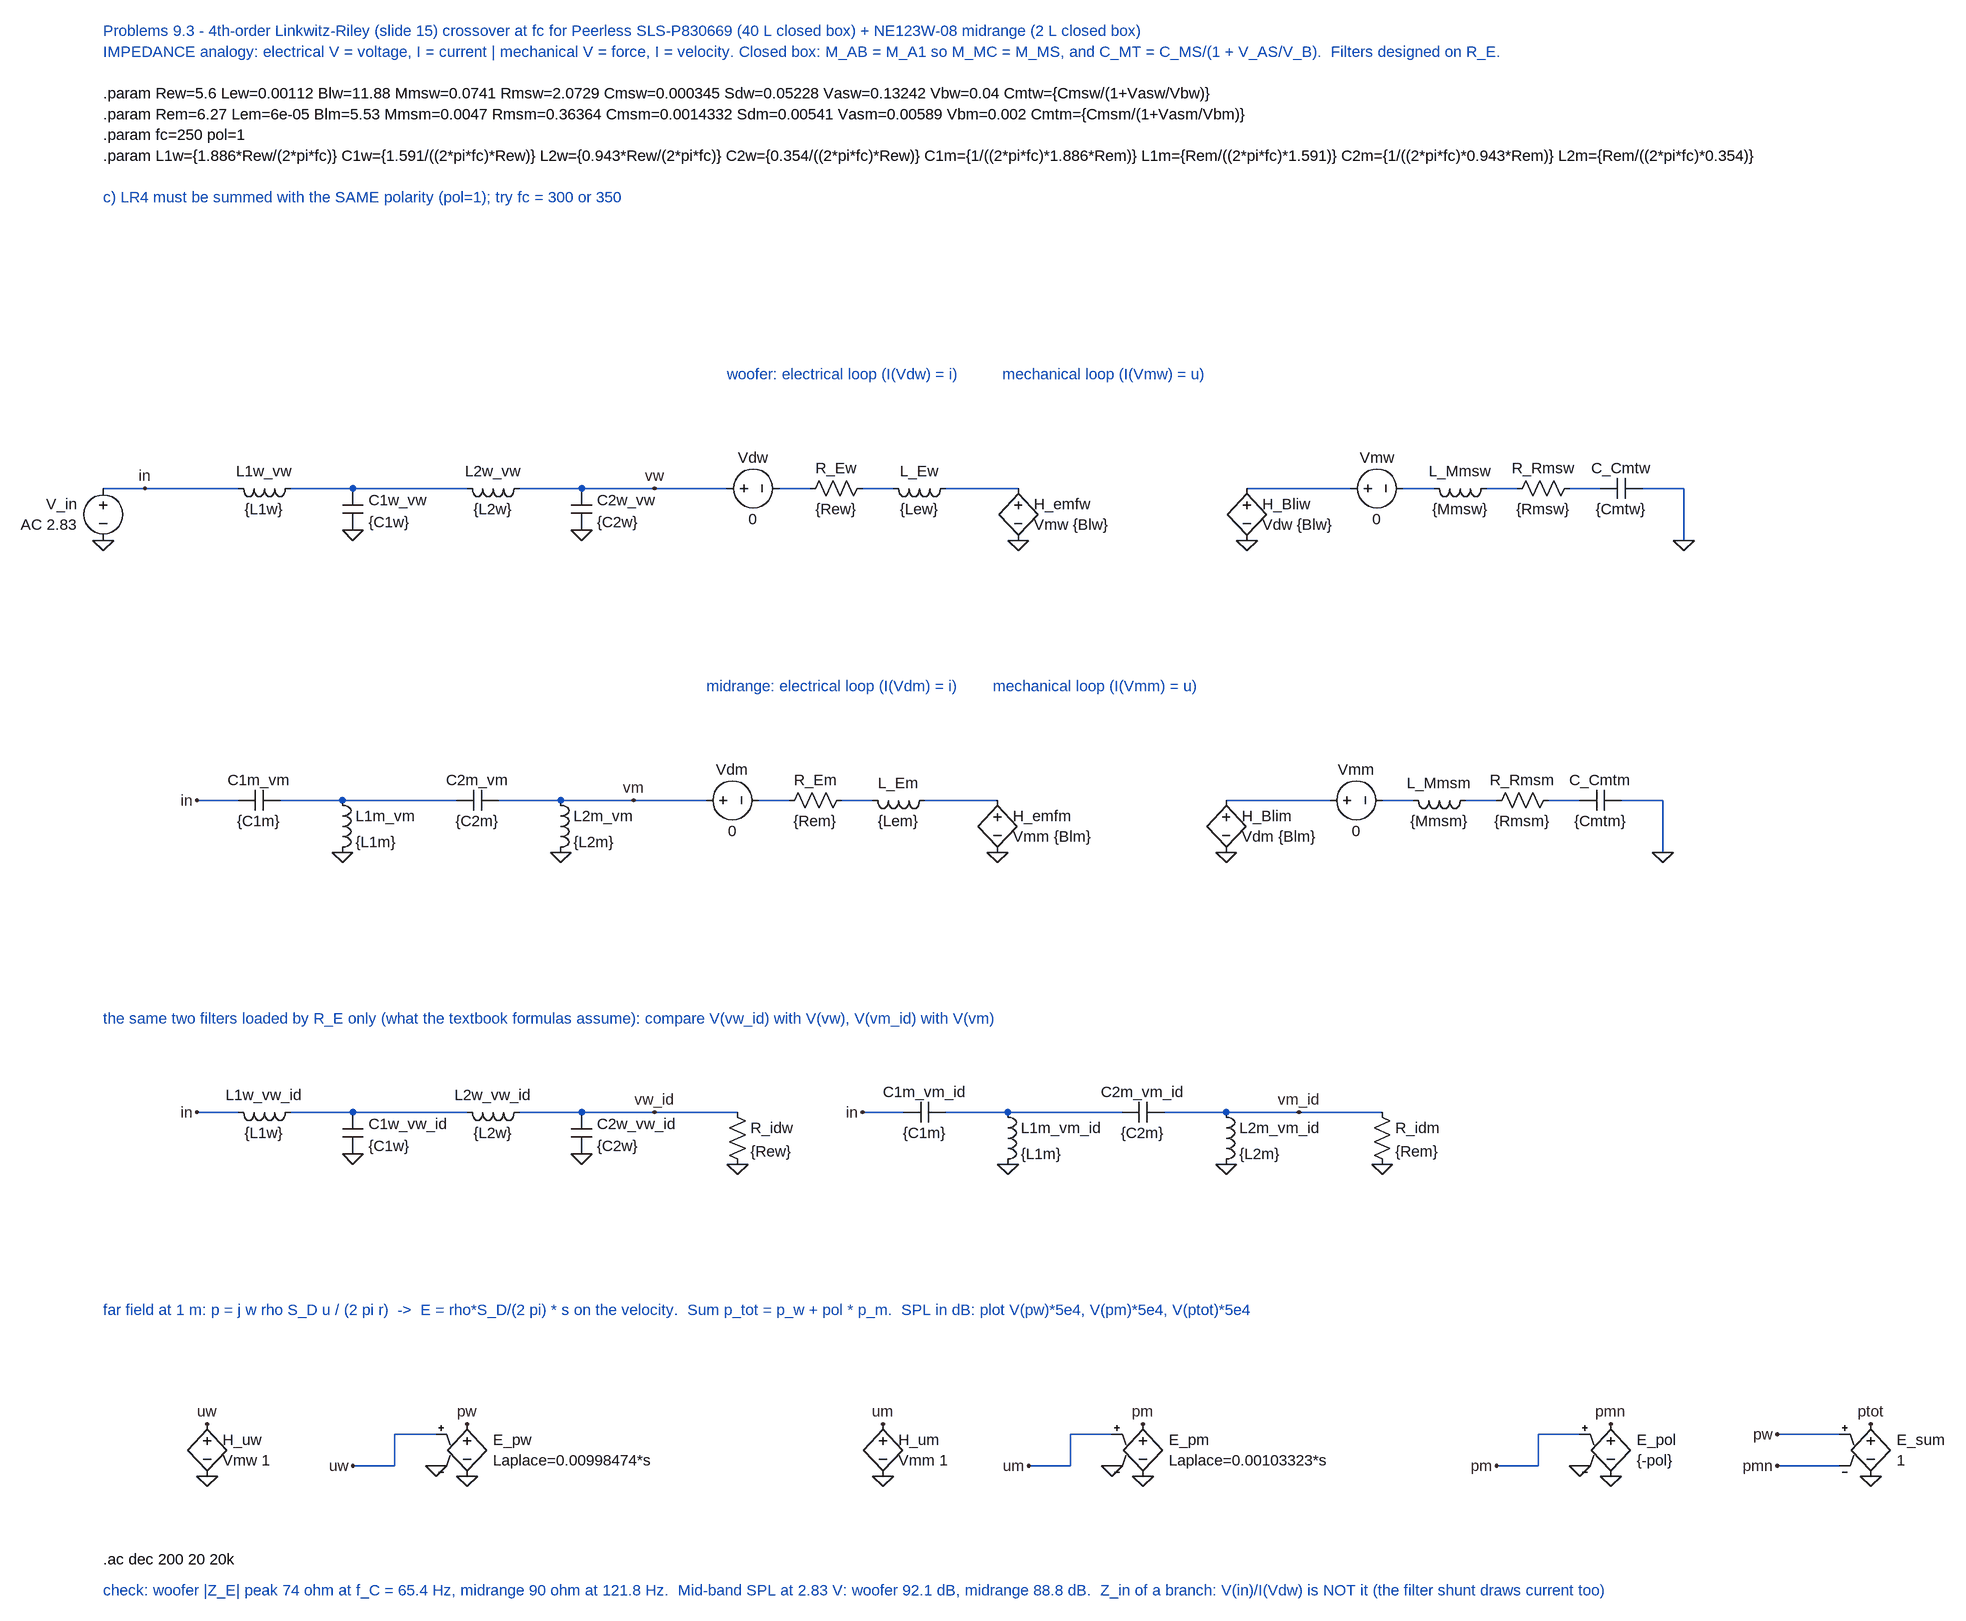
[diagram p0: schematic P9_3_LR4_250Hz.asc]
P9_3_LR4_250Hz.asc, the LTspice schematic file:
Version 4
SHEET 1 3000 1600
WIRE 0 0 144 0
WIRE 144 0 208 0
WIRE 288 0 384 0
WIRE 384 0 560 0
WIRE 640 0 736 0
WIRE 736 0 912 0
WIRE 1040 0 1088 0
WIRE 1168 0 1216 0
WIRE 1296 0 1408 0
WIRE 1760 0 1920 0
WIRE 2000 0 2048 0
WIRE 2128 0 2176 0
WIRE 2256 0 2304 0
WIRE 2368 0 2432 0
WIRE 2432 0 2432 80
WIRE 912 0 960 0
WIRE 144 480 208 480
WIRE 272 480 368 480
WIRE 368 480 544 480
WIRE 608 480 704 480
WIRE 704 480 880 480
WIRE 1008 480 1056 480
WIRE 1136 480 1184 480
WIRE 1264 480 1376 480
WIRE 1728 480 1888 480
WIRE 1968 480 2016 480
WIRE 2096 480 2144 480
WIRE 2224 480 2272 480
WIRE 2336 480 2400 480
WIRE 2400 480 2400 560
WIRE 880 480 928 480
WIRE 144 960 208 960
WIRE 288 960 384 960
WIRE 384 960 560 960
WIRE 640 960 736 960
WIRE 736 960 912 960
WIRE 912 960 976 960
WIRE 1168 960 1232 960
WIRE 1296 960 1392 960
WIRE 1392 960 1568 960
WIRE 1632 960 1728 960
WIRE 1728 960 1904 960
WIRE 1904 960 1968 960
WIRE 512 1456 448 1456
WIRE 448 1456 448 1504
WIRE 448 1504 384 1504
WIRE 1552 1456 1488 1456
WIRE 1488 1456 1488 1504
WIRE 1488 1504 1424 1504
WIRE 2272 1456 2208 1456
WIRE 2208 1456 2208 1504
WIRE 2208 1504 2144 1504
WIRE 2672 1456 2576 1456
WIRE 2672 1504 2576 1504
FLAG 0 80 0
FLAG 64 0 in
FLAG 384 64 0
FLAG 736 64 0
FLAG 848 0 vw
FLAG 1408 80 0
FLAG 1760 80 0
FLAG 2432 80 0
FLAG 144 480 in
FLAG 368 560 0
FLAG 704 560 0
FLAG 816 480 vm
FLAG 1376 560 0
FLAG 1728 560 0
FLAG 2400 560 0
FLAG 144 960 in
FLAG 384 1024 0
FLAG 736 1024 0
FLAG 848 960 vw_id
FLAG 976 1040 0
FLAG 1168 960 in
FLAG 1392 1040 0
FLAG 1728 1040 0
FLAG 1840 960 vm_id
FLAG 1968 1040 0
FLAG 160 1520 0
FLAG 160 1440 uw
FLAG 560 1520 0
FLAG 512 1504 0
FLAG 384 1504 uw
FLAG 560 1440 pw
FLAG 1200 1520 0
FLAG 1200 1440 um
FLAG 1600 1520 0
FLAG 1552 1504 0
FLAG 1424 1504 um
FLAG 1600 1440 pm
FLAG 2320 1520 0
FLAG 2272 1504 0
FLAG 2144 1504 pm
FLAG 2320 1440 pmn
FLAG 2720 1520 0
FLAG 2720 1440 ptot
FLAG 2576 1456 pw
FLAG 2576 1504 pmn
SYMBOL voltage 0 -16 R0
WINDOW 0 -40 40 Right 2
WINDOW 3 -40 72 Right 2
SYMATTR InstName V_in
SYMATTR Value AC 2.83
SYMBOL ind 304 -16 R90
WINDOW 0 5 56 VBottom 2
WINDOW 3 32 56 VTop 2
SYMATTR InstName L1w_vw
SYMATTR Value {L1w}
SYMATTR SpiceLine Rser=0
SYMBOL cap 368 0 R0
WINDOW 0 40 18 Left 2
WINDOW 3 40 52 Left 2
SYMATTR InstName C1w_vw
SYMATTR Value {C1w}
SYMBOL ind 656 -16 R90
WINDOW 0 5 56 VBottom 2
WINDOW 3 32 56 VTop 2
SYMATTR InstName L2w_vw
SYMATTR Value {L2w}
SYMATTR SpiceLine Rser=0
SYMBOL cap 720 0 R0
WINDOW 0 40 18 Left 2
WINDOW 3 40 52 Left 2
SYMATTR InstName C2w_vw
SYMATTR Value {C2w}
SYMBOL voltage 944 0 R270
WINDOW 0 32 56 VTop 2
WINDOW 3 -32 56 VBottom 2
SYMATTR InstName Vdw
SYMATTR Value 0
SYMBOL res 1184 -16 R90
WINDOW 0 0 56 VBottom 2
WINDOW 3 32 56 VTop 2
SYMATTR InstName R_Ew
SYMATTR Value {Rew}
SYMBOL ind 1312 -16 R90
WINDOW 0 5 56 VBottom 2
WINDOW 3 32 56 VTop 2
SYMATTR InstName L_Ew
SYMATTR Value {Lew}
SYMATTR SpiceLine Rser=0
SYMBOL h 1408 -16 R0
WINDOW 0 24 40 Left 2
WINDOW 3 24 72 Left 2
SYMATTR InstName H_emfw
SYMATTR Value Vmw {Blw}
SYMBOL h 1760 -16 R0
WINDOW 0 24 40 Left 2
WINDOW 3 24 72 Left 2
SYMATTR InstName H_Bliw
SYMATTR Value Vdw {Blw}
SYMBOL voltage 1904 0 R270
WINDOW 0 32 56 VTop 2
WINDOW 3 -32 56 VBottom 2
SYMATTR InstName Vmw
SYMATTR Value 0
SYMBOL ind 2144 -16 R90
WINDOW 0 5 56 VBottom 2
WINDOW 3 32 56 VTop 2
SYMATTR InstName L_Mmsw
SYMATTR Value {Mmsw}
SYMATTR SpiceLine Rser=0
SYMBOL res 2272 -16 R90
WINDOW 0 0 56 VBottom 2
WINDOW 3 32 56 VTop 2
SYMATTR InstName R_Rmsw
SYMATTR Value {Rmsw}
SYMBOL cap 2368 -16 R90
WINDOW 0 0 32 VBottom 2
WINDOW 3 32 32 VTop 2
SYMATTR InstName C_Cmtw
SYMATTR Value {Cmtw}
SYMBOL cap 272 464 R90
WINDOW 0 0 32 VBottom 2
WINDOW 3 32 32 VTop 2
SYMATTR InstName C1m_vm
SYMATTR Value {C1m}
SYMBOL ind 352 464 R0
SYMATTR InstName L1m_vm
SYMATTR Value {L1m}
SYMATTR SpiceLine Rser=0
SYMBOL cap 608 464 R90
WINDOW 0 0 32 VBottom 2
WINDOW 3 32 32 VTop 2
SYMATTR InstName C2m_vm
SYMATTR Value {C2m}
SYMBOL ind 688 464 R0
SYMATTR InstName L2m_vm
SYMATTR Value {L2m}
SYMATTR SpiceLine Rser=0
SYMBOL voltage 912 480 R270
WINDOW 0 32 56 VTop 2
WINDOW 3 -32 56 VBottom 2
SYMATTR InstName Vdm
SYMATTR Value 0
SYMBOL res 1152 464 R90
WINDOW 0 0 56 VBottom 2
WINDOW 3 32 56 VTop 2
SYMATTR InstName R_Em
SYMATTR Value {Rem}
SYMBOL ind 1280 464 R90
WINDOW 0 5 56 VBottom 2
WINDOW 3 32 56 VTop 2
SYMATTR InstName L_Em
SYMATTR Value {Lem}
SYMATTR SpiceLine Rser=0
SYMBOL h 1376 464 R0
WINDOW 0 24 40 Left 2
WINDOW 3 24 72 Left 2
SYMATTR InstName H_emfm
SYMATTR Value Vmm {Blm}
SYMBOL h 1728 464 R0
WINDOW 0 24 40 Left 2
WINDOW 3 24 72 Left 2
SYMATTR InstName H_Blim
SYMATTR Value Vdm {Blm}
SYMBOL voltage 1872 480 R270
WINDOW 0 32 56 VTop 2
WINDOW 3 -32 56 VBottom 2
SYMATTR InstName Vmm
SYMATTR Value 0
SYMBOL ind 2112 464 R90
WINDOW 0 5 56 VBottom 2
WINDOW 3 32 56 VTop 2
SYMATTR InstName L_Mmsm
SYMATTR Value {Mmsm}
SYMATTR SpiceLine Rser=0
SYMBOL res 2240 464 R90
WINDOW 0 0 56 VBottom 2
WINDOW 3 32 56 VTop 2
SYMATTR InstName R_Rmsm
SYMATTR Value {Rmsm}
SYMBOL cap 2336 464 R90
WINDOW 0 0 32 VBottom 2
WINDOW 3 32 32 VTop 2
SYMATTR InstName C_Cmtm
SYMATTR Value {Cmtm}
SYMBOL ind 304 944 R90
WINDOW 0 5 56 VBottom 2
WINDOW 3 32 56 VTop 2
SYMATTR InstName L1w_vw_id
SYMATTR Value {L1w}
SYMATTR SpiceLine Rser=0
SYMBOL cap 368 960 R0
WINDOW 0 40 18 Left 2
WINDOW 3 40 52 Left 2
SYMATTR InstName C1w_vw_id
SYMATTR Value {C1w}
SYMBOL ind 656 944 R90
WINDOW 0 5 56 VBottom 2
WINDOW 3 32 56 VTop 2
SYMATTR InstName L2w_vw_id
SYMATTR Value {L2w}
SYMATTR SpiceLine Rser=0
SYMBOL cap 720 960 R0
WINDOW 0 40 18 Left 2
WINDOW 3 40 52 Left 2
SYMATTR InstName C2w_vw_id
SYMATTR Value {C2w}
SYMBOL res 960 944 R0
SYMATTR InstName R_idw
SYMATTR Value {Rew}
SYMBOL cap 1296 944 R90
WINDOW 0 0 32 VBottom 2
WINDOW 3 32 32 VTop 2
SYMATTR InstName C1m_vm_id
SYMATTR Value {C1m}
SYMBOL ind 1376 944 R0
SYMATTR InstName L1m_vm_id
SYMATTR Value {L1m}
SYMATTR SpiceLine Rser=0
SYMBOL cap 1632 944 R90
WINDOW 0 0 32 VBottom 2
WINDOW 3 32 32 VTop 2
SYMATTR InstName C2m_vm_id
SYMATTR Value {C2m}
SYMBOL ind 1712 944 R0
SYMATTR InstName L2m_vm_id
SYMATTR Value {L2m}
SYMATTR SpiceLine Rser=0
SYMBOL res 1952 944 R0
SYMATTR InstName R_idm
SYMATTR Value {Rem}
SYMBOL h 160 1424 R0
WINDOW 0 24 40 Left 2
WINDOW 3 24 72 Left 2
SYMATTR InstName H_uw
SYMATTR Value Vmw 1
SYMBOL e 560 1424 R0
WINDOW 0 40 40 Left 2
WINDOW 3 40 72 Left 2
SYMATTR InstName E_pw
SYMATTR Value Laplace=0.00998474*s
SYMBOL h 1200 1424 R0
WINDOW 0 24 40 Left 2
WINDOW 3 24 72 Left 2
SYMATTR InstName H_um
SYMATTR Value Vmm 1
SYMBOL e 1600 1424 R0
WINDOW 0 40 40 Left 2
WINDOW 3 40 72 Left 2
SYMATTR InstName E_pm
SYMATTR Value Laplace=0.00103323*s
SYMBOL e 2320 1424 R0
WINDOW 0 40 40 Left 2
WINDOW 3 40 72 Left 2
SYMATTR InstName E_pol
SYMATTR Value {-pol}
SYMBOL e 2720 1424 R0
WINDOW 0 40 40 Left 2
WINDOW 3 40 72 Left 2
SYMATTR InstName E_sum
SYMATTR Value 1
TEXT 0 -704 Left 2 ;Problems 9.3 - 4th-order Linkwitz-Riley (slide 15) crossover at fc for Peerless SLS-P830669 (40 L closed box) + NE123W-08 midrange (2 L closed box)
TEXT 0 -672 Left 2 ;IMPEDANCE analogy: electrical V = voltage, I = current | mechanical V = force, I = velocity. Closed box: M_AB = M_A1 so M_MC = M_MS, and C_MT = C_MS/(1 + V_AS/V_B).  Filters designed on R_E.
TEXT 0 -608 Left 2 !.param Rew=5.6 Lew=0.00112 Blw=11.88 Mmsw=0.0741 Rmsw=2.0729 Cmsw=0.000345 Sdw=0.05228 Vasw=0.13242 Vbw=0.04 Cmtw={Cmsw/(1+Vasw/Vbw)}
TEXT 0 -576 Left 2 !.param Rem=6.27 Lem=6e-05 Blm=5.53 Mmsm=0.0047 Rmsm=0.36364 Cmsm=0.0014332 Sdm=0.00541 Vasm=0.00589 Vbm=0.002 Cmtm={Cmsm/(1+Vasm/Vbm)}
TEXT 0 -544 Left 2 !.param fc=250 pol=1
TEXT 0 -512 Left 2 !.param L1w={1.886*Rew/(2*pi*fc)} C1w={1.591/((2*pi*fc)*Rew)} L2w={0.943*Rew/(2*pi*fc)} C2w={0.354/((2*pi*fc)*Rew)} C1m={1/((2*pi*fc)*1.886*Rem)} L1m={Rem/((2*pi*fc)*1.591)} C2m={1/((2*pi*fc)*0.943*Rem)} L2m={Rem/((2*pi*fc)*0.354)}
TEXT 0 -448 Left 2 ;c) LR4 must be summed with the SAME polarity (pol=1); try fc = 300 or 350
TEXT 960 -176 Left 2 ;woofer: electrical loop (I(Vdw) = i)          mechanical loop (I(Vmw) = u)
TEXT 928 304 Left 2 ;midrange: electrical loop (I(Vdm) = i)        mechanical loop (I(Vmm) = u)
TEXT 0 816 Left 2 ;the same two filters loaded by R_E only (what the textbook formulas assume): compare V(vw_id) with V(vw), V(vm_id) with V(vm)
TEXT 0 1264 Left 2 ;far field at 1 m: p = j w rho S_D u / (2 pi r)  ->  E = rho*S_D/(2 pi) * s on the velocity.  Sum p_tot = p_w + pol * p_m.  SPL in dB: plot V(pw)*5e4, V(pm)*5e4, V(ptot)*5e4
TEXT 0 1648 Left 2 !.ac dec 200 20 20k
TEXT 0 1696 Left 2 ;check: woofer |Z_E| peak 74 ohm at f_C = 65.4 Hz, midrange 90 ohm at 121.8 Hz.  Mid-band SPL at 2.83 V: woofer 92.1 dB, midrange 88.8 dB.  Z_in of a branch: V(in)/I(Vdw) is NOT it (the filter shunt draws current too)

The netlist it stands for:
* P9_3_LR4_250Hz.asc
V_in in 0 AC 2.83
L1w_vw N001 in {L1w} Rser=0
C1w_vw N001 0 {C1w}
L2w_vw vw N001 {L2w} Rser=0
C2w_vw vw 0 {C2w}
Vdw vw N002 0
R_Ew N003 N002 {Rew}
L_Ew N004 N003 {Lew} Rser=0
H_emfw N004 0 Vmw {Blw}
H_Bliw N005 0 Vdw {Blw}
Vmw N005 N006 0
L_Mmsw N007 N006 {Mmsw} Rser=0
R_Rmsw N008 N007 {Rmsw}
C_Cmtw 0 N008 {Cmtw}
C1m_vm N009 in {C1m}
L1m_vm N009 0 {L1m} Rser=0
C2m_vm vm N009 {C2m}
L2m_vm vm 0 {L2m} Rser=0
Vdm vm N010 0
R_Em N011 N010 {Rem}
L_Em N012 N011 {Lem} Rser=0
H_emfm N012 0 Vmm {Blm}
H_Blim N013 0 Vdm {Blm}
Vmm N013 N014 0
L_Mmsm N015 N014 {Mmsm} Rser=0
R_Rmsm N016 N015 {Rmsm}
C_Cmtm 0 N016 {Cmtm}
L1w_vw_id N017 in {L1w} Rser=0
C1w_vw_id N017 0 {C1w}
L2w_vw_id vw_id N017 {L2w} Rser=0
C2w_vw_id vw_id 0 {C2w}
R_idw vw_id 0 {Rew}
C1m_vm_id N018 in {C1m}
L1m_vm_id N018 0 {L1m} Rser=0
C2m_vm_id vm_id N018 {C2m}
L2m_vm_id vm_id 0 {L2m} Rser=0
R_idm vm_id 0 {Rem}
H_uw uw 0 Vmw 1
E_pw pw 0 uw 0 Laplace=0.00998474*s
H_um um 0 Vmm 1
E_pm pm 0 um 0 Laplace=0.00103323*s
E_pol pmn 0 pm 0 {-pol}
E_sum ptot 0 pw pmn 1
* Problems 9.3 - 4th-order Linkwitz-Riley (slide 15) crossover at fc for Peerless SLS-P830669 (40 L closed box) + NE123W-08 midrange (2 L closed box)
* IMPEDANCE analogy: electrical V = voltage, I = current | mechanical V = force, I = velocity. Closed box: M_AB = M_A1 so M_MC = M_MS, and C_MT = C_MS/(1 + V_AS/V_B).  Filters designed on R_E.
.param Rew=5.6 Lew=0.00112 Blw=11.88 Mmsw=0.0741 Rmsw=2.0729 Cmsw=0.000345 Sdw=0.05228 Vasw=0.13242 Vbw=0.04 Cmtw={Cmsw/(1+Vasw/Vbw)}
.param Rem=6.27 Lem=6e-05 Blm=5.53 Mmsm=0.0047 Rmsm=0.36364 Cmsm=0.0014332 Sdm=0.00541 Vasm=0.00589 Vbm=0.002 Cmtm={Cmsm/(1+Vasm/Vbm)}
.param fc=250 pol=1
.param L1w={1.886*Rew/(2*pi*fc)} C1w={1.591/((2*pi*fc)*Rew)} L2w={0.943*Rew/(2*pi*fc)} C2w={0.354/((2*pi*fc)*Rew)} C1m={1/((2*pi*fc)*1.886*Rem)} L1m={Rem/((2*pi*fc)*1.591)} C2m={1/((2*pi*fc)*0.943*Rem)} L2m={Rem/((2*pi*fc)*0.354)}
* c) LR4 must be summed with the SAME polarity (pol=1); try fc = 300 or 350
* woofer: electrical loop (I(Vdw) = i)          mechanical loop (I(Vmw) = u)
* midrange: electrical loop (I(Vdm) = i)        mechanical loop (I(Vmm) = u)
* the same two filters loaded by R_E only (what the textbook formulas assume): compare V(vw_id) with V(vw), V(vm_id) with V(vm)
* far field at 1 m: p = j w rho S_D u / (2 pi r)  ->  E = rho*S_D/(2 pi) * s on the velocity.  Sum p_tot = p_w + pol * p_m.  SPL in dB: plot V(pw)*5e4, V(pm)*5e4, V(ptot)*5e4
.ac dec 200 20 20k
* check: woofer |Z_E| peak 74 ohm at f_C = 65.4 Hz, midrange 90 ohm at 121.8 Hz.  Mid-band SPL at 2.83 V: woofer 92.1 dB, midrange 88.8 dB.  Z_in of a branch: V(in)/I(Vdw) is NOT it (the filter shunt draws current too)
.backanno
.end